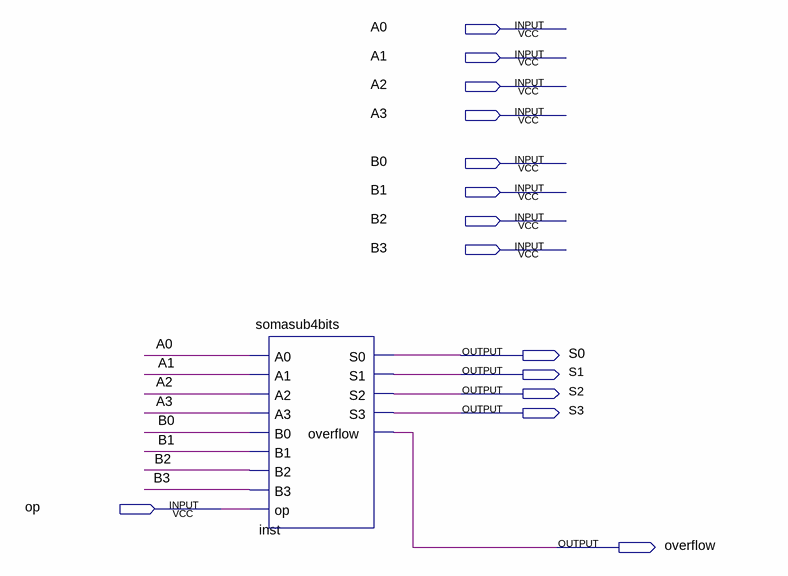
[diagram p0: schematic sheet]
// Quartus schematic sumasub.bdf as structural Verilog: 1 symbols, 14 pins
module sumasub (
  input  A0,
  input  A1,
  input  A2,
  input  A3,
  input  B0,
  input  B1,
  input  B2,
  input  B3,
  input  op,
  output S0,
  output S1,
  output S2,
  output S3,
  output overflow
);

  somasub4bits inst (
    .A0(A0), .A1(A1), .A2(A2), .A3(A3), .B0(B0), .B1(B1), .B2(B2), .B3(B3), .op(op), .S0(S0), .S1(S1),
    .S2(S2), .S3(S3), .overflow(overflow));
endmodule
